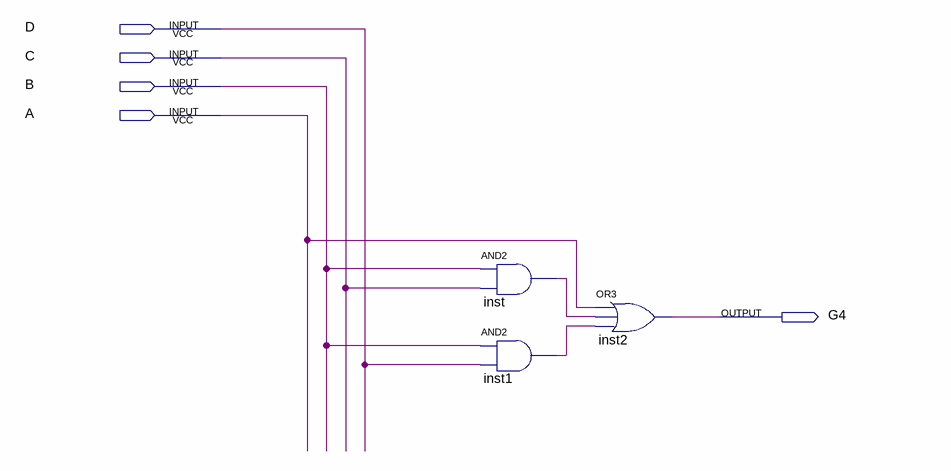
[diagram p0: schematic sheet]
// Quartus schematic g4.bdf as structural Verilog: 3 symbols, 5 pins
module g4 (
  input  D,
  input  C,
  input  B,
  input  A,
  output G4
);

  wire inst1_out, inst_out;

  and inst (inst_out, B, C);
  and inst1 (inst1_out, B, D);
  or inst2 (G4, A, inst_out, inst1_out);
endmodule
